# Altium schematic sheet shahbazi5v.SchDoc
size A3
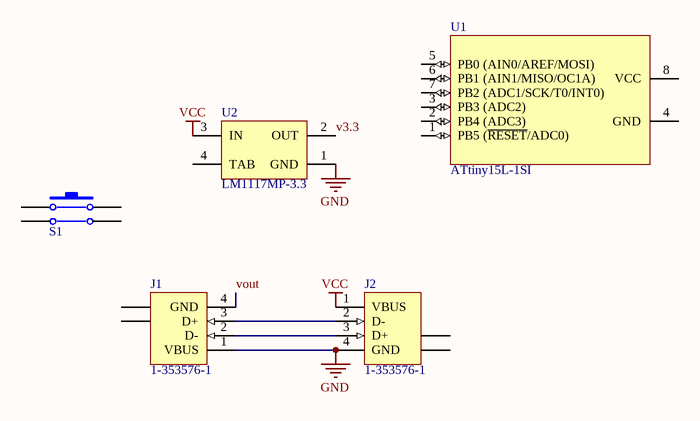
[diagram p0: shahbazi5v.SchDoc]

## Parts
J1  1-353576-1  [353576]
J2  1-353576-1  [353576]
S1  PUSH BUTTON DOUBLE  [PUSH BUTTON]  (value not drawn)
U1  ATtiny15L-1SI  [8S2_N]
U2  LM1117MP-3.3  [MP04A_N]

## Nets
GND: J1.1(VBUS) J2.4(GND) U2.1(GND)
VCC: J2.1(VBUS) U2.3(IN)
v3.3: U2.2(OUT)
vout: J1.4(GND)
NetJ1_2: J1.2(D-) J2.3(D+)
NetJ1_3: J1.3(D+) J2.2(D-)

Not connected (* = marked no-connect by the designer): J1 5(SHLD) 6(SHLD); J2 5(SHLD) 6(SHLD); S1 1 2 3 4; U1 1(PB5_(~{RESET}/ADC0)) 2(PB4_(ADC3)) 3(PB3_(ADC2)) 4(GND) 5(PB0_(AIN0/AREF/MOSI)) 6(PB1_(AIN1/MISO/OC1A)) 7(PB2_(ADC1/SCK/T0/INT0)) 8(VCC); U2 4(TAB)

## Library data of the parts
J1 J2 = 1-353576-1: USB 1.1, Right Angle, SMT, A Type, Receptacle, 4 Position, White; ContactMaterial: Copper Alloy; ContactPlating: Gold over Palladium Nickel; PCB_Layout: Complies with manufacturer's recommendation.; DrillSize: Corresponds to nominal value.; PanelGround: Without; Published: 15-Jul-2004; DatasheetDocument: 11-Apr-2003; PackageDocument: 11-Apr-2003; PackageReference: 353576; Publisher: Altium Limited; HousingMaterial: Thermoplastic; ComponentLink1Description: Manufacturer Link; ComponentLink1URL: http://www.tycoelectronics.com/; ComponentLink2Description: Packaging Specification; ComponentLink2URL: http://ecommas.tycoelectronics.com/commerce/DocumentDelivery/DDEController?Action=showdoc&DocId=Customer+Drawing%7F353576%7FD%7Ftif%7FJapanese%7FJPN_CD_353576_D.tif
S1 = PUSH BUTTON DOUBLE: Switch
U1 = ATtiny15L-1SI: 8-Bit AVR Microcontroller with 1K Byte of Flash Memory; Published: 17-Sep-2003; LatestRevisionDate: 16-Oct-2006; LatestRevisionNote: IPC-7351 Footprint Added.; DatasheetVersion: 1187E-AVR-06/02; PackageVersion: revF, Apr-2008; PackageReference: 8S2; Publisher: Altium Limited; PackageDescription: 8-Lead, 0.208" Body, Plastic Small Outline Package (EIAJ); Supplier 1: Digi-Key; Supplier Part Number 1: ATTINY15L-1SI-ND; Supplier 2: Farnell; Supplier Part Number 2: 3618018; Supplier 3: Mouser; Supplier Part Number 3: 556-ATTINY15L1SI; ComponentLink1Description: Datasheet; ComponentLink1URL: http://www.atmel.com/dyn/resources/prod_documents/doc1187.pdf; ComponentLink2Description: Atmel.com Home; ComponentLink2URL: http://www.atmel.com
U2 = LM1117MP-3.3: 800mA Low-Dropout Linear Regulator; Manufacturer: National Semiconductor; CompType: LDO IC; PackageTopMarking: XYTT*N05A; PowerWise: N; Published: 4-Dec-2008; DatasheetVersion: Apr-2006; PackageVersion: revB, Apr-2003; PackageReference: MP04A; Publisher: Altium Limited; PackageDescription: Molded SOT-223, 6.50 x 3.56 x 1.6mm Body, 4 Lead, 2.3mm Pitch; PartNumber: LM1117MP-3.3; RoHS: O; PinCount: 4; DigiKeyPartNumber: LM1117MP-3.3CT-ND; Code_JEDEC: TO-261-AA; Code_IPC: SOT223-4; ComponentLink1Description: LM1117 Datasheet; ComponentLink1URL: http://www.national.com/ds/LM/LM1117.pdf; ComponentLink2Description: LM1117 Web Page; ComponentLink2URL: http://www.national.com/pf/LM/LM1117.html; ComponentLink3Description: MP04A Package Page; ComponentLink3URL: http://www.national.com/packaging/folders/mp04a.html